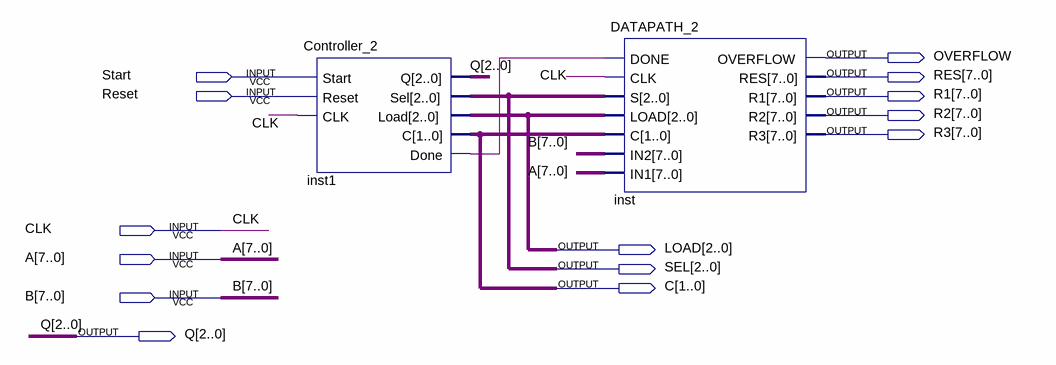
[diagram p0: schematic sheet]
// Quartus schematic Bai2.bdf as structural Verilog: 2 symbols, 14 pins
module Bai2 (
  input  Start,
  input  Reset,
  input  CLK,
  input  [7:0] A,
  input  [7:0] B,
  output OVERFLOW,
  output [7:0] RES,
  output [7:0] R1,
  output [7:0] R2,
  output [7:0] R3,
  output [2:0] LOAD,
  output [2:0] SEL,
  output [1:0] C,
  output [2:0] Q
);

  wire inst1_done;

  Controller_2 inst1 (.Start(Start), .Reset(Reset), .CLK(CLK), .Q(Q), .Sel(SEL), .Load(LOAD), .C(C), .Done(inst1_done));
  DATAPATH_2 inst (
    .DONE(inst1_done), .CLK(CLK), .S(SEL), .LOAD(LOAD), .C(C), .IN2(B), .IN1(A), .OVERFLOW(OVERFLOW),
    .RES(RES), .R1(R1), .R2(R2), .R3(R3));
endmodule
